# Altium schematic sheet Half_Bridges.SchDoc
size B; DocumentNumber: 6; SheetNumber: 4; SheetTotal: 4
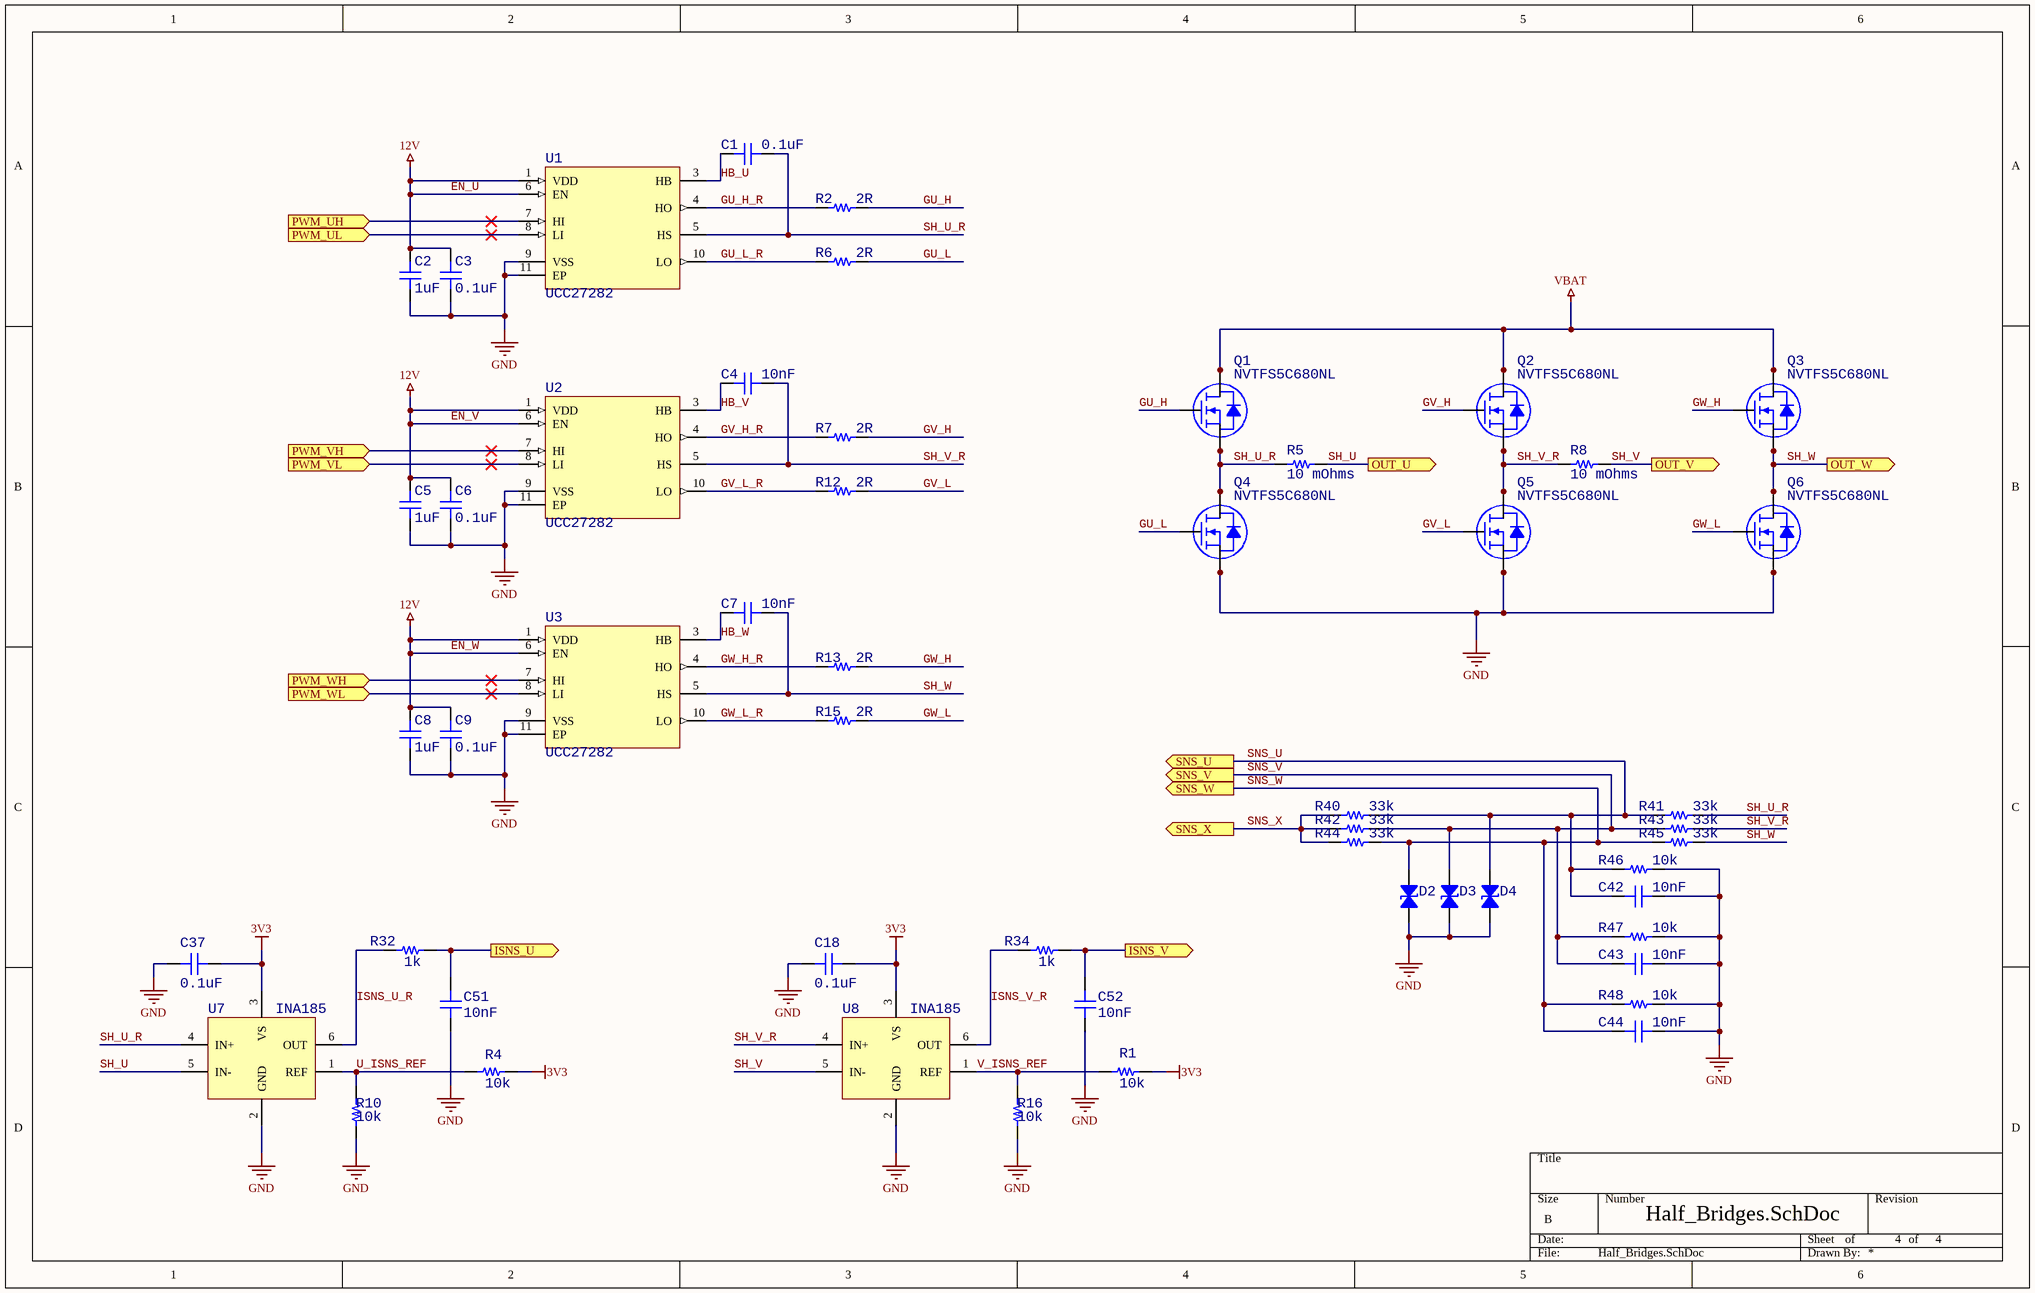
[diagram p0: Half_Bridges.SchDoc]

## Parts
C1  0.1uF  [CAP_0402]
C2  1uF  [CAP_0402]
C3  0.1uF  [CAP_0402]
C4  10nF  [CAP_0402]
C5  1uF  [CAP_0402]
C6  0.1uF  [CAP_0402]
C7  10nF  [CAP_0402]
C8  1uF  [CAP_0402]
C9  0.1uF  [CAP_0402]
C18  0.1uF  [CAP_0402]
C37  0.1uF  [CAP_0402]
C42  10nF  [CAP_0402]
C43  10nF  [CAP_0402]
C44  10nF  [CAP_0402]
C51  10nF  [CAP_0402]
C52  10nF  [CAP_0402]
D2  TVN3V3B1S-DFN1006-2LDG  [0402]  (value not drawn)
D3  TVN3V3B1S-DFN1006-2LDG  [0402]  (value not drawn)
D4  TVN3V3B1S-DFN1006-2LDG  [0402]  (value not drawn)
Q1  NVTFS5C680NL  [NVTFS015N04CTAG]
Q2  NVTFS5C680NL  [NVTFS015N04CTAG]
Q3  NVTFS5C680NL  [NVTFS015N04CTAG]
Q4  NVTFS5C680NL  [NVTFS015N04CTAG]
Q5  NVTFS5C680NL  [NVTFS015N04CTAG]
Q6  NVTFS5C680NL  [NVTFS015N04CTAG]
R1  10k  [RES_0402]
R2  2R  [RES_0402]
R4  10k  [RES_0402]
R5  10 mOhms  [RES 1206_3216]
R6  2R  [RES_0402]
R7  2R  [RES_0402]
R8  10 mOhms  [RES 1206_3216]
R10  10k  [RES_0402]
R12  2R  [RES_0402]
R13  2R  [RES_0402]
R15  2R  [RES_0402]
R16  10k  [RES_0402]
R32  1k  [RES_0402]
R34  1k  [RES_0402]
R40  33k  [RES_0402]
R41  33k  [RES_0402]
R42  33k  [RES_0402]
R43  33k  [RES_0402]
R44  33k  [RES_0402]
R45  33k  [RES_0402]
R46  10k  [RES_0402]
R47  10k  [RES_0402]
R48  10k  [RES_0402]
U1  UCC27282  [VSON-10]
U2  UCC27282  [VSON-10]
U3  UCC27282  [VSON-10]
U7  INA185  [TI SC70-6 DCK]
U8  INA185  [TI SC70-6 DCK]

## Ports
ISNS_U (out), ISNS_V (out), OUT_U (out), OUT_V (out), OUT_W (out), PWM_UH (in), PWM_UL (in), PWM_VH (in), PWM_VL (in), PWM_WH (in), PWM_WL (in), SNS_U (out), SNS_V (out), SNS_W (out), SNS_X (out)

## Nets
3V3: C18.1 C37.1 R1.1 R4.1 U7.3(VS) U8.3(VS)
EN_U: C2.1 C3.1 C5.1 C6.1 C8.1 C9.1 U1.1(VDD) U1.6(EN) U2.1(VDD) U2.6(EN) U3.1(VDD) U3.6(EN)  [also labelled 12V, EN_V, EN_W]
GND: C2.2 C3.2 C5.2 C6.2 C8.2 C9.2 C18.2 C37.2 C42.1 C43.1 C44.1 C51.2 C52.2 D2.1 D3.1 D4.1 Q4.1(S) Q4.2(S) Q4.3(S) Q5.1(S) Q5.2(S) Q5.3(S) Q6.1(S) Q6.2(S) Q6.3(S) R10.2 R16.2 R46.2 R47.2 R48.2 U1.9(VSS) U1.11(EP) U2.9(VSS) U2.11(EP) U3.9(VSS) U3.11(EP) U7.2(GND) U8.2(GND)
VBAT: Q1.5(D) Q1.6(D) Q1.7(D) Q1.8(D) Q2.5(D) Q2.6(D) Q2.7(D) Q2.8(D) Q3.5(D) Q3.6(D) Q3.7(D) Q3.8(D)
GU_H: Q1.4(G) R2.2
GU_H_R: R2.1 U1.4(HO)
GU_L: Q4.4(G) R6.2
GU_L_R: R6.1 U1.10(LO)
GV_H: Q2.4(G) R7.2
GV_H_R: R7.1 U2.4(HO)
GV_L: Q5.4(G) R12.2
GV_L_R: R12.1 U2.10(LO)
GW_H: Q3.4(G) R13.2
GW_H_R: R13.1 U3.4(HO)
GW_L: Q6.4(G) R15.2
GW_L_R: R15.1 U3.10(LO)
HB_U: C1.2 U1.3(HB)
HB_V: C4.2 U2.3(HB)
HB_W: C7.2 U3.3(HB)
ISNS_U: C51.1 R32.1 ; port ISNS_U
ISNS_U_R: R32.2 U7.6(OUT)
ISNS_V: C52.1 R34.1 ; port ISNS_V
ISNS_V_R: R34.2 U8.6(OUT)
PWM_UH: U1.7(HI) ; port PWM_UH
PWM_UL: U1.8(LI) ; port PWM_UL
PWM_VH: U2.7(HI) ; port PWM_VH
PWM_VL: U2.8(LI) ; port PWM_VL
PWM_WH: U3.7(HI) ; port PWM_WH
PWM_WL: U3.8(LI) ; port PWM_WL
SH_U: R5.2 U7.5(IN-) ; port OUT_U
SH_U_R: C1.1 Q1.1(S) Q1.2(S) Q1.3(S) Q4.5(D) Q4.6(D) Q4.7(D) Q4.8(D) R5.1 R41.1 U1.5(HS) U7.4(IN+)
SH_V: R8.2 U8.5(IN-) ; port OUT_V
SH_V_R: C4.1 Q2.1(S) Q2.2(S) Q2.3(S) Q5.5(D) Q5.6(D) Q5.7(D) Q5.8(D) R8.1 R43.1 U2.5(HS) U8.4(IN+)
SH_W: C7.1 Q3.1(S) Q3.2(S) Q3.3(S) Q6.5(D) Q6.6(D) Q6.7(D) Q6.8(D) R45.1 U3.5(HS) ; port OUT_W
SNS_U: C42.2 D4.2 R40.1 R41.2 R46.1 ; port SNS_U
SNS_V: C43.2 D3.2 R42.1 R43.2 R47.1 ; port SNS_V
SNS_W: C44.2 D2.2 R44.1 R45.2 R48.1 ; port SNS_W
SNS_X: R40.2 R42.2 R44.2 ; port SNS_X
U_ISNS_REF: R4.2 R10.1 U7.1(REF)
V_ISNS_REF: R1.2 R16.1 U8.1(REF)

## Notes on the sheet
- of

## Library data of the parts
C1-C9 C18 C37 C42-C44 C51 C52 = CAP_0402: CAP CER 402
  C1 C3 C6 C9 C18 C37: Value: 0.1uF
  C2 C5 C8: Value: 1uF
  C4 C7 C42-C44 C51 C52: Value: 10nF
D2-D4 = TVN3V3B1S-DFN1006-2LDG: TVS DIODE 3.3V 14.2PF DFN1006; Manufacturer: INPAQ Technology Co., Ltd; Bidirectional Channels: 1; Capacitance @ Frequency: 11.5pF @ 1MHz; Current - Peak Pulse (10/1000µs): 8A (8/20µs); Power Line Protection: No; Type: Zener; Voltage - Breakdown (Min): 4V; Voltage - Clamping (Max) @ Ipp: 6.6V (Typ); Voltage - Reverse Standoff (Typ): 3.3V (Max); Part Number: TVN3V3B1S-DFN1006-2LDG; Applications: General Purpose; ComponentLink1Description: Datasheet; ComponentLink1URL: https://mm.digikey.com/Volume0/opasdata/d220001/medias/docus/5383/TVN3V3B1S-DFN1006-2LDG.pdf; ComponentLink2Description: DigiKey Link; ComponentLink2URL: https://www.digikey.com/en/products/detail/inpaq-technology-co-ltd/TVN3V3B1S-DFN1006-2LDG/20486686; Device Package: 0402 (1005 Metric); LastUpdated: 6/3/2024 8:22:57 PM; Lifecycle Status: Active; Minimum Order: 1; Mounting Type: Surface Mount; Operating Temperature: 150°C (TJ); Package / Case: 0402 (1005 Metric); Packaging: TapeAndReel; PartId: 11821; Price: 0.02; Series: TVN; Supplier 1: DigiKey; Supplier Part Number 1: 3526-TVN3V3B1S-DFN1006-2LDGCT-ND; Supplier Device Package: DFN1006
Q1-Q6 = NVTFS5C680NL: N-FET
R1 R2 R4 R6 R7 R10 R12 R13 R15 R16 R32 R34 R40-R48 = RES_0402: RES 0402
R5 R8 = KRL1632E-M-R039-F-T5: RES 0.039 OHM 1% 3/4W 1206; Manufacturer: Susumu; Power (Watts): 0.75W, 3/4W; Resistance: 39 mOhms; Temperature Coefficient: ±50ppm/°C; Value: 39 mOhms; Part Number: KRL1632E-M-R039-F-T5; ComponentLink1Description: Datasheet; ComponentLink1URL: http://www.susumu.co.jp/common/pdf/n_catalog_partition09_en.pdf; ComponentLink2Description: DigiKey Link; ComponentLink2URL: https://www.digikey.com/en/products/detail/susumu/KRL1632E-M-R039-F-T5/3738003; Composition: Metal Foil; Device Package: 1206 (3216 Metric); Features: Automotive AEC-Q200, Current Sense; Height - Seated (Max): 0.028" (0.70mm); LastUpdated: 2/9/2024 8:54:46 PM; Lifecycle Status: Active; Minimum Order: 1; Number of Terminations: 2; Operating Temperature: -55°C ~ 155°C; Package / Case: 1206 (3216 Metric); Packaging: TapeAndReel; PartId: 26838; Part Status: Active; Price: 0.09; Ratings: AEC-Q200; Series: KRL; Size / Dimension: 0.126" L x 0.063" W (3.20mm x 1.60mm); Supplier 1: DigiKey; Supplier Part Number 1: 408-1577-1-ND; Supplier Device Package: 1206; Tolerance: ±1%
U1-U3 = UCC27282DRCR: 3-A, 120-V half bridge gate driver with 5-V UVLO, interlock and enable 10-VSON -40 to 125; MF: Texas Instruments; Texas_Instruments-Purchase-URL: https://snapeda.com/shop?store=Texas+Instruments&id=3625400; Price: None; Availability: Warning; Package: VSON-10 Texas Instruments; SnapEDA_Link: https://www.snapeda.com/parts/UCC27282DRCR/Texas%20Instruments/view-part/3625400/?ref=snap; DigiKey-Purchase-URL: https://snapeda.com/shop?store=DigiKey&id=3625400; MP: UCC27282DRCR; Value: *
U7 U8 = INA185: INA185A2